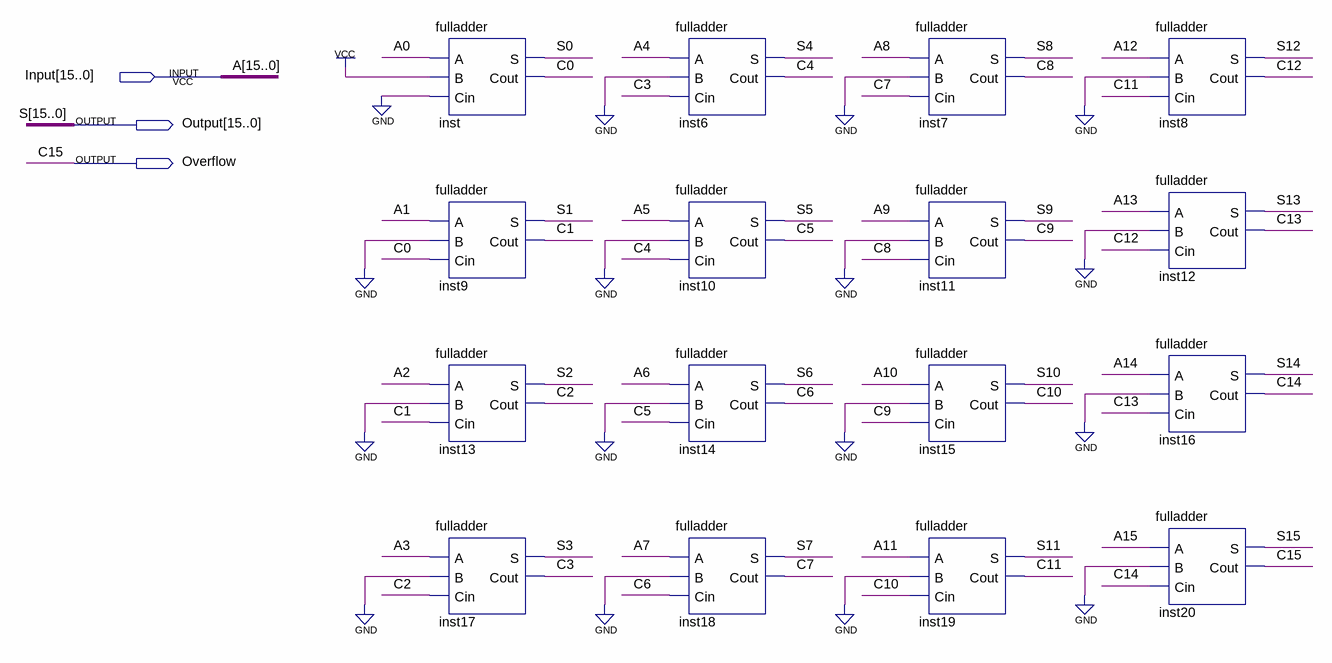
[diagram p0: schematic sheet]
// Quartus schematic add.bdf as structural Verilog: 16 symbols, 3 pins
module add (
  input  [15:0] Input,
  output [15:0] Output,
  output Overflow
);

  wire C0, C1, C2, C3, C4, C5, C6, C7, C8, C9, C10, C11, C12, C13, C14;

  fulladder inst (.A(Input[0]), .B(1'b1), .Cin(1'b0), .S(Output[0]), .Cout(C0));
  fulladder inst9 (.A(Input[1]), .B(1'b0), .Cin(C0), .S(Output[1]), .Cout(C1));
  fulladder inst13 (.A(Input[2]), .B(1'b0), .Cin(C1), .S(Output[2]), .Cout(C2));
  fulladder inst17 (.A(Input[3]), .B(1'b0), .Cin(C2), .S(Output[3]), .Cout(C3));
  fulladder inst6 (.A(Input[4]), .B(1'b0), .Cin(C3), .S(Output[4]), .Cout(C4));
  fulladder inst10 (.A(Input[5]), .B(1'b0), .Cin(C4), .S(Output[5]), .Cout(C5));
  fulladder inst14 (.A(Input[6]), .B(1'b0), .Cin(C5), .S(Output[6]), .Cout(C6));
  fulladder inst18 (.A(Input[7]), .B(1'b0), .Cin(C6), .S(Output[7]), .Cout(C7));
  fulladder inst7 (.A(Input[8]), .B(1'b0), .Cin(C7), .S(Output[8]), .Cout(C8));
  fulladder inst11 (.A(Input[9]), .B(1'b0), .Cin(C8), .S(Output[9]), .Cout(C9));
  fulladder inst15 (.A(Input[10]), .B(1'b0), .Cin(C9), .S(Output[10]), .Cout(C10));
  fulladder inst19 (.A(Input[11]), .B(1'b0), .Cin(C10), .S(Output[11]), .Cout(C11));
  fulladder inst8 (.A(Input[12]), .B(1'b0), .Cin(C11), .S(Output[12]), .Cout(C12));
  fulladder inst12 (.A(Input[13]), .B(1'b0), .Cin(C12), .S(Output[13]), .Cout(C13));
  fulladder inst16 (.A(Input[14]), .B(1'b0), .Cin(C13), .S(Output[14]), .Cout(C14));
  fulladder inst20 (.A(Input[15]), .B(1'b0), .Cin(C14), .S(Output[15]), .Cout(Overflow));

  // Other names for the same wires on the sheet: A[15:0] = Input; A0 = Input[0]; A1 = Input[1]; A2 = Input[2];
  //   A3 = Input[3]; A4 = Input[4]; A5 = Input[5]; A6 = Input[6]; A7 = Input[7]; A8 = Input[8]; A9 = Input[9];
  //   A10 = Input[10]; A11 = Input[11]; A12 = Input[12]; A13 = Input[13]; A14 = Input[14]; A15 = Input[15];
  //   C15 = Overflow; S[15:0] = Output; S0 = Output[0]; S1 = Output[1]; S2 = Output[2]; S3 = Output[3];
  //   S4 = Output[4]; S5 = Output[5]; S6 = Output[6]; S7 = Output[7]; S8 = Output[8]; S9 = Output[9];
  //   S10 = Output[10]; S11 = Output[11]; S12 = Output[12]; S13 = Output[13]; S14 = Output[14]; S15 = Output[15]
endmodule
